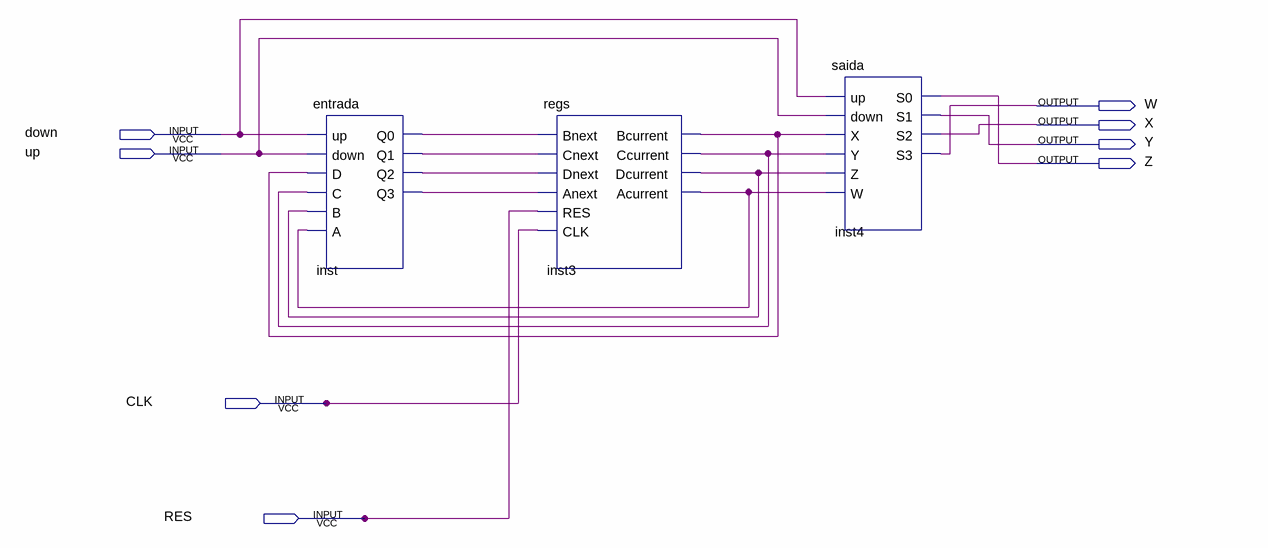
[diagram p0: schematic sheet]
// Quartus schematic MealyMachine.bdf as structural Verilog: 3 symbols, 8 pins
module MealyMachine (
  input  down,
  input  up,
  input  CLK,
  input  RES,
  output W,
  output X,
  output Y,
  output Z
);

  wire inst3_acurrent, inst3_bcurrent, inst3_ccurrent, inst3_dcurrent, inst_q0, inst_q1, inst_q2, inst_q3;

  entrada inst (
    .up(down), .down(up), .D(inst3_bcurrent), .C(inst3_ccurrent), .B(inst3_dcurrent), .A(inst3_acurrent),
    .Q0(inst_q0), .Q1(inst_q1), .Q2(inst_q2), .Q3(inst_q3));
  regs inst3 (
    .Bnext(inst_q0), .Cnext(inst_q1), .Dnext(inst_q2), .Anext(inst_q3), .RES(RES), .CLK(CLK),
    .Bcurrent(inst3_bcurrent), .Ccurrent(inst3_ccurrent), .Dcurrent(inst3_dcurrent), .Acurrent(inst3_acurrent));
  saida inst4 (
    .up(down), .down(up), .X(inst3_bcurrent), .Y(inst3_ccurrent), .Z(inst3_dcurrent), .W(inst3_acurrent),
    .S0(Z), .S1(Y), .S2(X), .S3(W));
endmodule
